# EAGLE design BALPGAS (EAGLE 7.2.0)
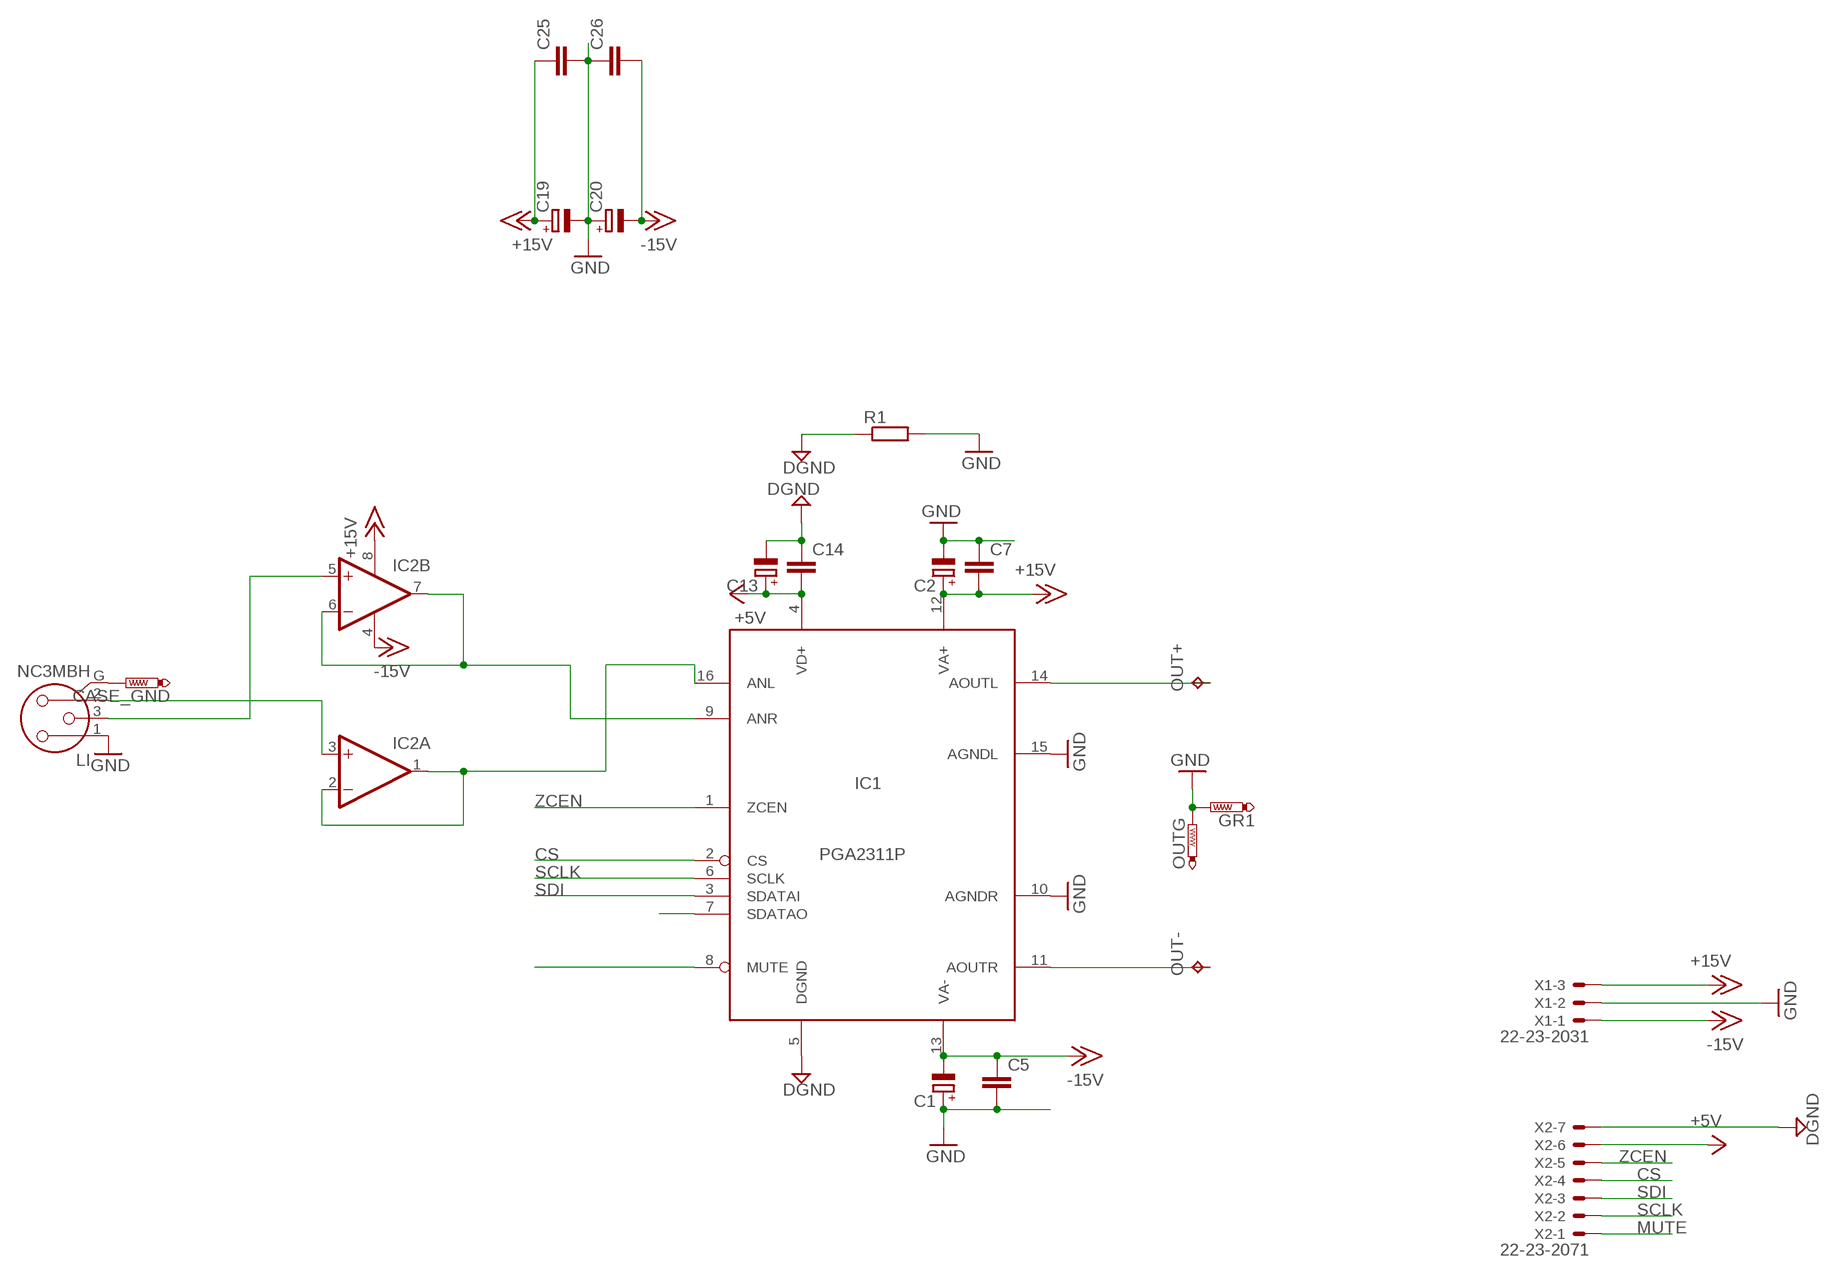
[diagram p0: schematic, sheet 1]

## Parts
C1  CPOL-EUE5-10.5  [E5-10,5]
C2  CPOL-EUE5-10.5  [E5-10,5]
C5  C-EU050-045X075  [C050-045X075]
C7  C-EU050-045X075  [C050-045X075]
C13  CPOL-EUSMCD  [SMC_D]
C14  C-EUC1206  [C1206]
C19  CPOL-EUE5-10.5  [E5-10,5]
C20  CPOL-EUE5-10.5  [E5-10,5]
C25  C-EU050-045X075  [C050-045X075]
C26  C-EU050-045X075  [C050-045X075]
CASE_GND  PTR1PAD1-17  [P1-17]
GR1  PTR1PAD1-17  [P1-17]
IC1  PGA2311P  [DIL16]
IC2  2AMP_P8+4N  [DIL08]
LI  NC3MBH  [NC3MBH]
OUT+  TPPAD1-20  [P1-20]
OUT-  TPPAD1-20  [P1-20]
OUTG  PTR1PAD1-17  [P1-17]
R1  R-EU_0207/10  [0207/10]
X1  22-23-2031  [22-23-2031]
X2  22-23-2071  [22-23-2071]

## Nets
+5V: C13.+ C14.2 IC1.4(VD+) X2.6
+15V: C2.+ C7.2 C19.+ C25.1 IC1.12(VA+) IC2.8(P:V+) X1.3
-15V: C1.- C5.1 C20.- C26.2 IC1.13(VA-) IC2.4(P:V-) X1.1
CS: IC1.2(CS) X2.4
DGND: C13.- C14.1 IC1.5(DGND) R1.1 X2.7
GND: C1.+ C2.- C5.2 C7.1 C19.- C20.+ C25.2 C26.1 GR1.TP IC1.10(AGNDR) IC1.15(AGNDL) LI.1 OUTG.TP R1.2 X1.2
MUTE: IC1.8(MUTE) X2.1
N$1: IC1.9(ANR) IC2.6(B:-IN) IC2.7(B:OUT)
N$2: IC2.3(A:+IN) LI.2
N$3: CASE_GND.TP LI.G
N$4: IC2.5(B:+IN) LI.3
N$9: IC1.7(SDATAO)
N$10: IC1.16(ANL) IC2.1(A:OUT) IC2.2(A:-IN)
N$11: IC1.11(AOUTR) OUT-.TP
N$12: IC1.14(AOUTL) OUT+.TP
SCLK: IC1.6(SCLK) X2.2
SDI: IC1.3(SDATAI) X2.3
ZCEN: IC1.1(ZCEN) X2.5

## Library data of the parts
C1 C2 C19 C20 = Vwvwbg:CPOL-EU: POLARIZED CAPACITOR, European symbol
C5 C7 C25 C26 = Vwvwbg:C-EU: CAPACITOR, European symbol
C13 = resistor:CPOL-EU: POLARIZED CAPACITOR, European symbol
C14 = resistor:C-EU: CAPACITOR, European symbol
CASE_GND GR1 OUTG = testpad:PTR1: TEST PIN
IC1 = Vwvwbg:PGA2311
IC2 = linear:2AMP_P8+4: OP AMP
LI = con-neutrik_ag:NC3: Neutrik Audio Connector XLR SERIES Stereo 1/4" jack Source: www.neutrik.com/; MF: NEUTRIK; MPN: NC3MBH; OC_FARNELL: unknown; OC_NEWARK: 91F3470
OUT+ OUT- = testpad:TP: Test pad
R1 = resistor:R-EU_: RESISTOR, European symbol
X1 = con-molex:22-23-2031: .100" (2.54mm) Center Header - 3 Pin; MF: MOLEX; MPN: 22-23-2031; OC_FARNELL: 1462950; OC_NEWARK: 30C0862
X2 = con-molex:22-23-2071: .100" (2.54mm) Center Header - 7 Pin; MF: MOLEX; MPN: 22-23-2071; OC_FARNELL: 1654534; OC_NEWARK: 56H0445

## Board
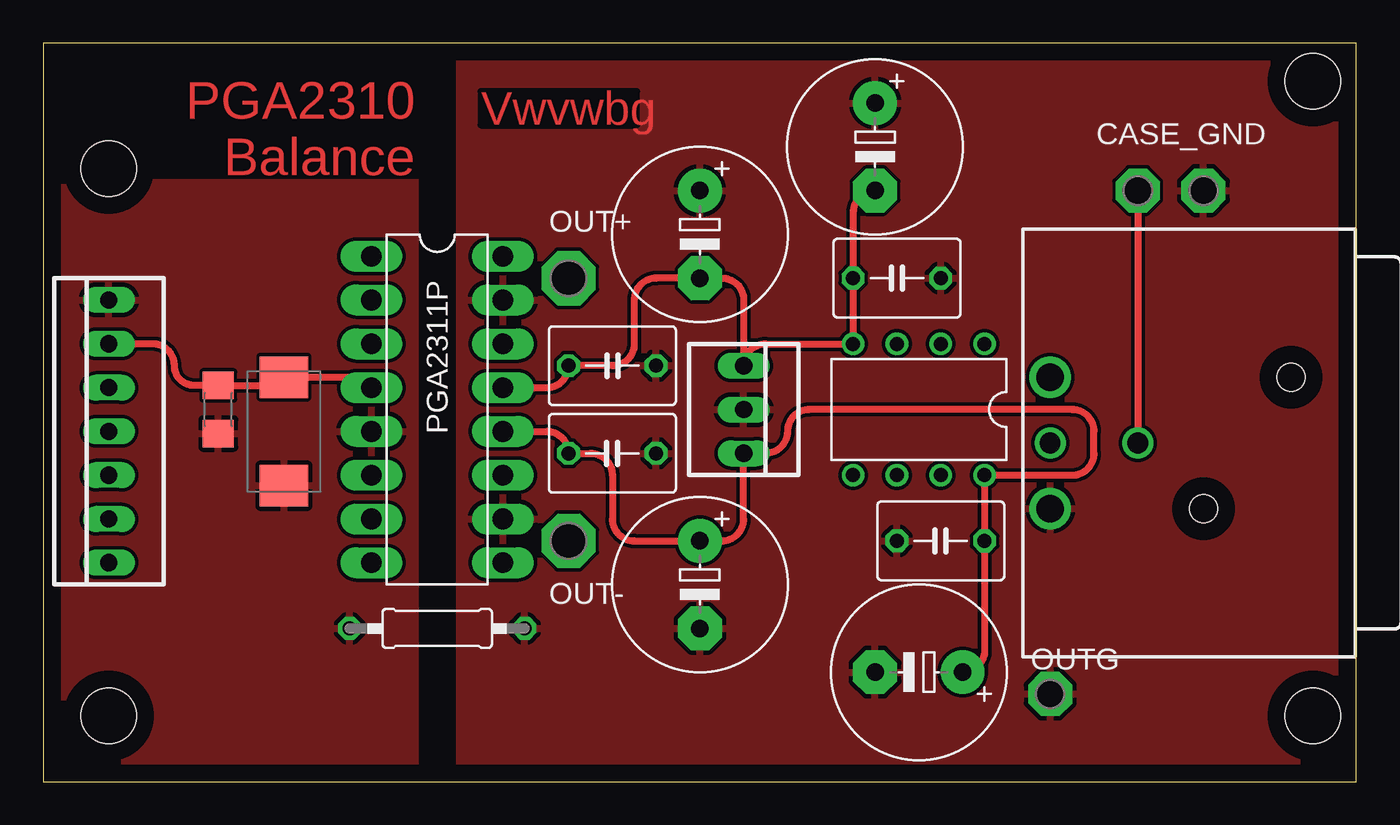
[diagram p1: board, top side]
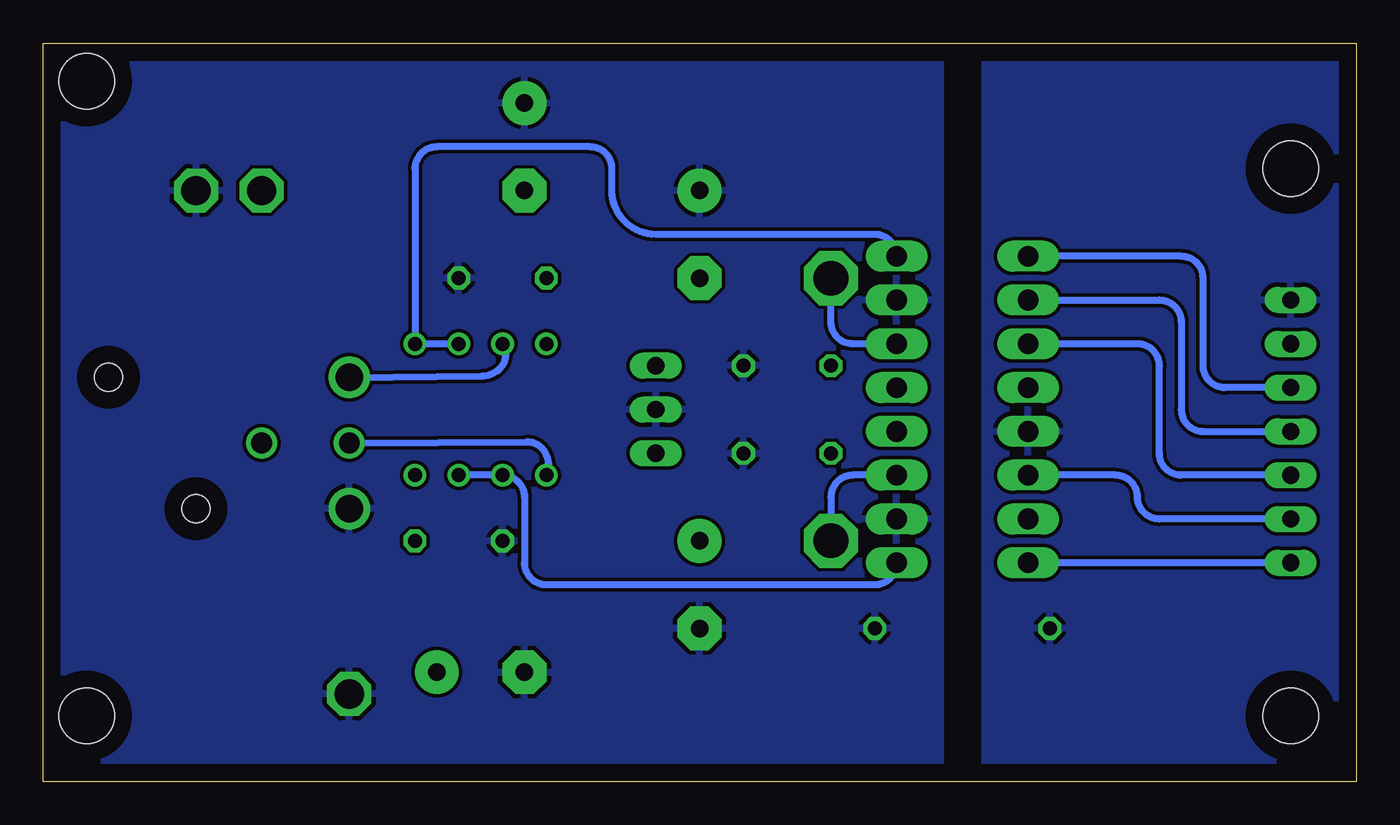
[diagram p2: board, bottom side, seen from below]

Size 76.18 x 42.85 mm. Coordinates in mm from the lower left corner, seen from the top.
Outline: 0,0 76.18,0 76.18,42.85 0,42.85 0,0
Copper layers (1*16): Top 0.035mm / dielectric 1.5mm / Bottom 0.035mm
Design rules "default": minimum track width 10mil, minimum drill 24mil, track to track 8mil, track to pad 8mil, pad to pad 8mil, via to via 8mil, smd to smd 8mil, copper to edge 40mil, drill to drill 8mil, minimum pad ring 10mil, minimum via ring 8mil, stop-mask expansion 4mil, vias tented up to drill 0mil, thermal gap 10mil
Holes 3.2 mm at 3.81,3.81 73.66,3.81 73.66,40.64 3.81,35.56

### Footprints (pad centres in the part's own frame; a part is rotated, then mirrored left to right if it is on the bottom)
E5-10,5 = drill 1.016 pad 2.54: + -2.54,0 | drill 1.016 pad 2.54 octagon: - 2.54,0
C050-045X075 = drill 0.813 octagon: 1 -2.54,0; 2 2.54,0
SMC_D = smd 2.4 x 2.8: + -3.15,0; - 3.15,0
C1206 = smd 1.6 x 1.8: 1 -1.4,0; 2 1.4,0
P1-17 = drill 1.702 pad 2.54 octagon: TP 0,0
DIL16 = drill 1.2 long: 1 -8.89,-3.81; 2 -6.35,-3.81; 3 -3.81,-3.81; 4 -1.27,-3.81; 5 1.27,-3.81; 6 3.81,-3.81; 7 6.35,-3.81; 8 8.89,-3.81; 9 8.89,3.81; 10 6.35,3.81; 11 3.81,3.81; 12 1.27,3.81; 13 -1.27,3.81; 14 -3.81,3.81; 15 -6.35,3.81; 16 -8.89,3.81
DIL08 = drill 0.813 pad 1.27: 1 -3.81,-3.81; 2 -1.27,-3.81; 3 1.27,-3.81; 4 3.81,-3.81; 5 3.81,3.81; 6 1.27,3.81; 7 -1.27,3.81; 8 -3.81,3.81
NC3MBH = drill 1.6: 1 3.81,0; 2 -3.81,0 | drill 1.2: 3 0,0; G 0,5.08 | hole 1.6: -3.81,13.97; 3.81,8.89
P1-20 = drill 2.007 pad 3.15 octagon: TP 0,0
0207/10 = drill 0.813 octagon: 1 -5.08,0; 2 5.08,0
22-23-2031 = drill 1 long: 1 -2.54,0; 2 0,0; 3 2.54,0
22-23-2071 = drill 1 long: 1 -7.62,0; 2 -5.08,0; 3 -2.54,0; 4 0,0; 5 2.54,0; 6 5.08,0; 7 7.62,0

### Placement (x,y rotation side)
C1  38.1,31.75 270 top
C2  38.1,11.43 270 top
C5  33.02,24.13 0 top
C7  33.02,19.05 180 top
C13  13.97,20.32 270 top
C14  10.16,21.59 90 top
C19  50.8,6.35 180 top
C20  48.26,36.83 270 top
C25  52.07,13.97 180 top
C26  49.53,29.21 180 top
CASE_GND  63.5,34.29 0 top
GR1  67.31,34.29 0 top
IC1  22.86,21.59 270 top
IC2  50.8,21.59 180 top
LI  58.42,19.65 270 top
OUT+  30.48,29.21 0 top
OUT-  30.48,13.97 0 top
OUTG  58.42,5.08 0 top
R1  22.86,8.89 0 top
X1  40.64,21.59 270 top
X2  3.81,20.32 90 top

### Tracks (layer width: path | path; a pad name or v marks a point on that pad's centre or on a via)
+5V
  Top 0.406: IC1.4 arc90 18.44,23.47 C13.+ arc-90 13.49,22.99 C14.2 8.76,22.99 arc-90 7.62,24.13 arc90 6.35,25.4 X2.6
+15V
  Top 0.406: IC1.12 29.21,20.32 arc-90 C7.2 31.75,19.05 arc-90 33.02,17.78 33.02,15.24 arc90 34.29,13.97 C2.+ 39.37,13.97 arc90 40.64,15.24 X1.3 41.91,19.05 arc90 43.18,20.32 arc-90 44.45,21.59 59.69,21.59 arc-90 60.96,20.32 60.96,19.05 arc-90 59.69,17.78 IC2.8 C25.1 54.61,7.62 arc-90 C19.+
-15V
  Top 0.406: IC1.13 29.21,22.86 arc90 C5.1 33.02,24.13 arc90 34.29,25.4 34.29,27.94 arc-90 35.56,29.21 C1.- 39.37,29.21 arc-90 40.64,27.94 X1.1 arc-90 41.91,25.4 IC2.4 C26.2 46.99,33.02 arc-90 C20.-
CS
  Bottom 0.406: IC1.2 11.43,27.94 arc90 10.16,26.67 10.16,21.59 arc-90 8.89,20.32 X2.4
DGND
  pour Top: -5.08,45.72 21.59,46.99 21.59,-6.35 -3.81,-3.81
  pour Bottom: -5.08,44.45 21.59,44.45 21.59,-2.54 -5.08,-2.54
GND
  pour Top: 24.13,48.26 24.13,-3.81 76.2,-3.81 76.2,48.26
  pour Bottom: 24.13,46.99 24.13,-6.35 81.28,-6.35 81.28,46.99
MUTE
  Bottom 0.406: X2.1 IC1.8
N$1
  Bottom 0.406: IC2.7 IC2.6 arc90 48.26,16.51 48.26,12.7 arc-90 46.99,11.43 27.94,11.43 arc-90 IC1.9
N$2
  Bottom 0.406: LI.2 50.79,23.53 arc-40 49.74,23.92 arc-83 IC2.3
N$3
  Top 0.406: CASE_GND.TP LI.G
N$4
  Bottom 0.406: LI.3 48.12,19.72 arc55 47.13,19.21 arc59 IC2.5
N$10
  Bottom 0.406: IC2.2 IC2.1 54.61,35.56 arc90 53.34,36.83 44.45,36.83 arc90 43.18,35.56 43.18,34.29 arc-90 40.64,31.75 27.94,31.75 arc90 IC1.16
N$11
  Bottom 0.406: IC1.11 29.21,17.78 arc-90 30.48,16.51 OUT-.TP
N$12
  Bottom 0.406: IC1.14 29.21,25.4 arc90 30.48,26.67 OUT+.TP
SCLK
  Bottom 0.406: X2.2 11.43,15.24 arc90 12.7,16.51 arc-90 13.97,17.78 IC1.6
SDI
  Bottom 0.406: X2.3 10.16,17.78 arc90 11.43,19.05 11.43,24.13 arc-90 12.7,25.4 IC1.3
ZCEN
  Bottom 0.406: X2.5 7.62,22.86 arc90 8.89,24.13 8.89,29.21 arc-90 10.16,30.48 IC1.1

### Text on the board
Top: PGA2310 / Balance | Vwvwbg